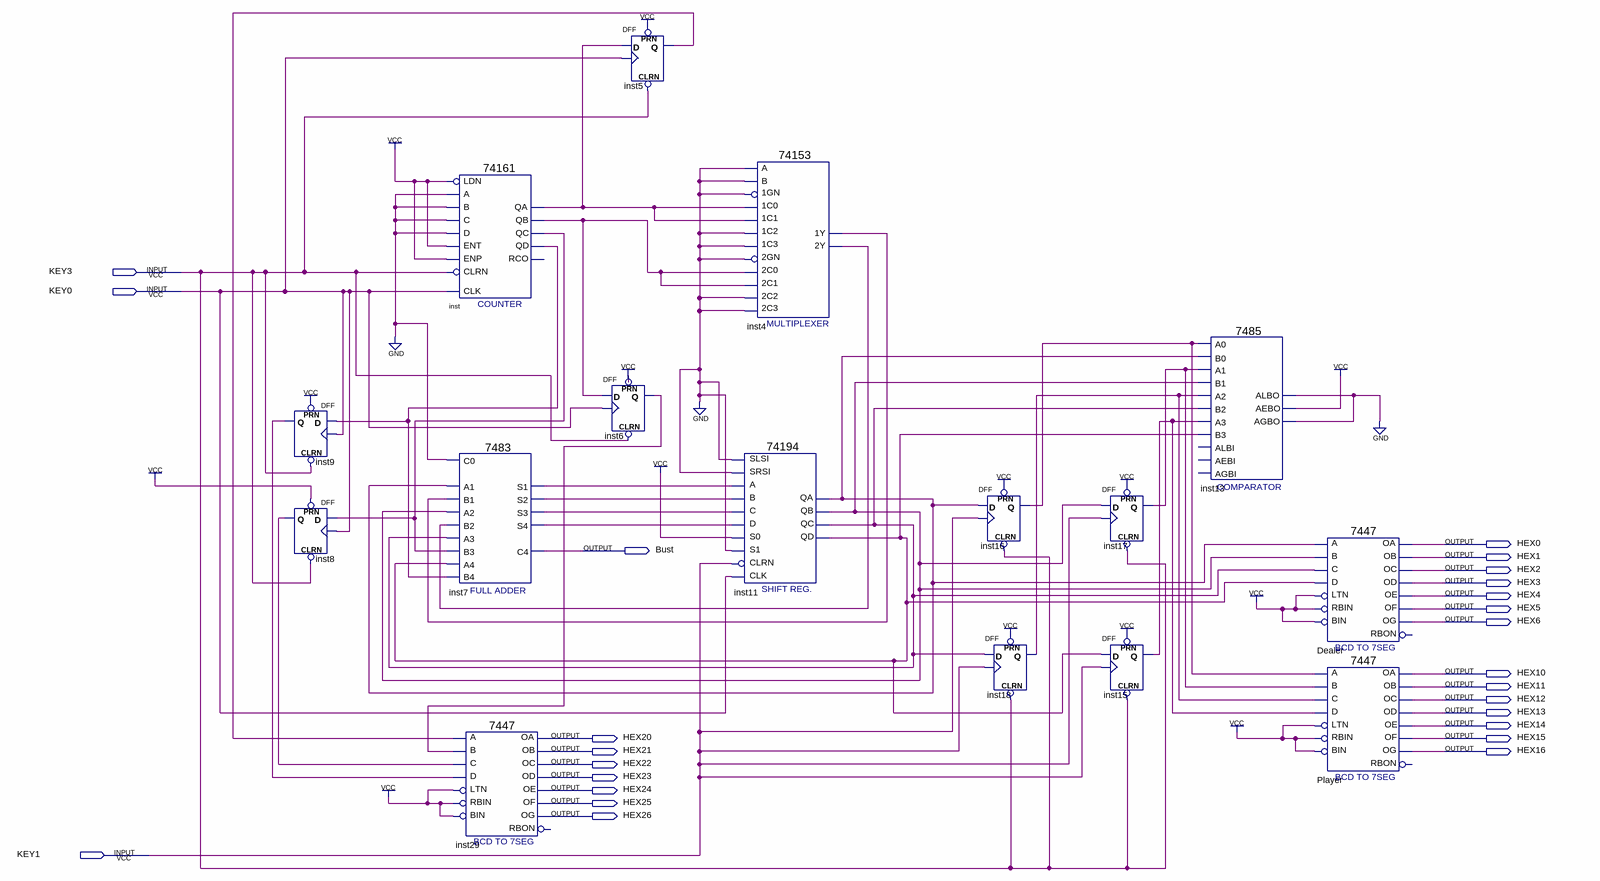
[diagram p0: schematic sheet]
// Quartus schematic blackjack.bdf.bdf as structural Verilog: 16 symbols, 25 pins
module \blackjack.bdf  (
  input  KEY3,
  input  KEY0,
  input  KEY1,
  output HEX0,
  output Bust,
  output HEX1,
  output HEX2,
  output HEX3,
  output HEX4,
  output HEX5,
  output HEX6,
  output HEX10,
  output HEX11,
  output HEX12,
  output HEX13,
  output HEX14,
  output HEX20,
  output HEX15,
  output HEX21,
  output HEX16,
  output HEX22,
  output HEX23,
  output HEX24,
  output HEX25,
  output HEX26
);

  wire inst4_1y, inst4_2y, inst5_q, inst6_q, inst7_s1, inst7_s2, inst7_s3, inst7_s4, inst8_q, inst9_q,
       inst11_qa, inst11_qb, inst11_qc, inst11_qd, inst13_aebo, inst13_albo, inst15_q, inst16_q, inst17_q,
       inst18_q, inst_qa, inst_qb, inst_qc, inst_qd;

  DFF inst9 (.CLRN(KEY3), .CLK(KEY0), .D(inst_qd), .PRN(1'b1), .Q(inst9_q));
  DFF inst8 (.CLRN(KEY3), .CLK(KEY0), .D(inst_qc), .PRN(1'b1), .Q(inst8_q));
  \74161  inst (
    .CLRN(KEY3), .CLK(KEY0), .ENP(1'b1), .LDN(1'b1), .A(1'b0), .D(1'b0), .ENT(1'b1), .B(1'b0), .C(1'b0),
    .QD(inst_qd), .QC(inst_qc), .QB(inst_qb), .QA(inst_qa));  // open: RCO
  \7483  inst7 (
    .B4(inst_qd), .C0(1'b0), .A1(inst11_qa), .A2(inst11_qb), .B1(inst4_1y), .B2(inst4_2y), .A3(inst11_qc),
    .B3(inst_qc), .A4(inst11_qd), .S3(inst7_s3), .S4(inst7_s4), .S2(inst7_s2), .C4(Bust), .S1(inst7_s1));
  \7447  inst29 (
    .LTN(1'b1), .B(inst6_q), .C(inst8_q), .D(inst9_q), .RBIN(1'b1), .BIN(1'b1), .A(inst5_q), .OB(HEX21),
    .OC(HEX22), .OE(HEX24), .OD(HEX23), .OF(HEX25), .OG(HEX26), .OA(HEX20));  // open: RBON
  DFF inst5 (.CLRN(KEY3), .CLK(KEY0), .D(inst_qa), .PRN(1'b1), .Q(inst5_q));
  DFF inst6 (.CLRN(KEY3), .CLK(KEY0), .D(inst_qb), .PRN(1'b1), .Q(inst6_q));
  \74194  inst11 (
    .SLSI(1'b0), .SRSI(1'b0), .B(inst7_s2), .C(inst7_s3), .CLK(KEY0), .CLRN(KEY1), .D(inst7_s4), .S1(1'b0),
    .S0(1'b1), .A(inst7_s1), .QA(inst11_qa), .QB(inst11_qb), .QC(inst11_qc), .QD(inst11_qd));
  \74153  inst4 (
    .\1C1 (inst_qa), .\1GN (1'b0), .\1C0 (inst_qa), .\2C0 (inst_qb), .\2GN (1'b0), .\2C2 (1'b0),
    .\1C2 (1'b0), .\1C3 (1'b0), .B(1'b0), .A(1'b0), .\2C1 (inst_qb), .\2C3 (1'b0), .\1Y (inst4_1y),
    .\2Y (inst4_2y));
  DFF inst16 (.CLRN(KEY3), .CLK(KEY1), .D(inst11_qa), .PRN(1'b1), .Q(inst16_q));
  DFF inst18 (.CLRN(KEY3), .CLK(KEY1), .D(inst11_qc), .PRN(1'b1), .Q(inst18_q));
  DFF inst17 (.CLRN(KEY3), .CLK(KEY1), .D(inst11_qb), .PRN(1'b1), .Q(inst17_q));
  DFF inst15 (.CLRN(KEY3), .CLK(KEY1), .D(inst11_qd), .PRN(1'b1), .Q(inst15_q));
  \7485  inst13 (
    .A3(inst15_q), .B2(inst11_qc), .A2(inst18_q), .A0(inst16_q), .B0(inst11_qa), .B3(inst11_qd),
    .A1(inst17_q), .B1(inst11_qb), .ALBO(inst13_albo), .AGBO(inst13_albo), .AEBO(inst13_aebo));  // open: AEBI, AGBI, ALBI
  \7447  Dealer (
    .LTN(1'b1), .B(inst11_qb), .C(inst11_qc), .D(inst11_qd), .RBIN(1'b1), .BIN(1'b1), .A(inst11_qa),
    .OB(HEX1), .OC(HEX2), .OE(HEX4), .OD(HEX3), .OF(HEX5), .OG(HEX6), .OA(HEX0));  // open: RBON
  \7447  Player (
    .LTN(1'b1), .B(inst17_q), .C(inst18_q), .D(inst15_q), .RBIN(1'b1), .BIN(1'b1), .A(inst16_q), .OB(HEX11),
    .OC(HEX12), .OE(HEX14), .OD(HEX13), .OF(HEX15), .OG(HEX16), .OA(HEX10));  // open: RBON
  // also tied to GND on the sheet: inst13_albo
  // also tied to VCC on the sheet: inst13_aebo
endmodule
